# Altium schematic sheet driver.SchDoc
size A4; SheetNumber: 2; SheetTotal: 4
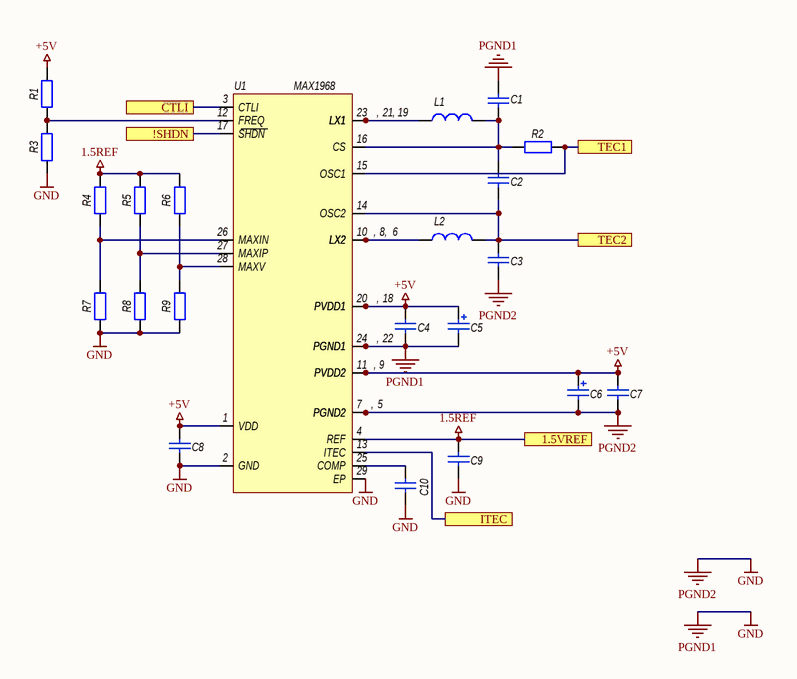
[diagram p0: driver.SchDoc]

## Parts
C1  0603 1u 6.3V  [CAP_0805]  (value not drawn)
C2  0805 10u 6.3V  [CAP_0805]  (value not drawn)
C3  0603 1u 6.3V  [CAP_0805]  (value not drawn)
C4  0603 1u 6.3V  [CAP_0805]  (value not drawn)
C5  47u 63V  [CAP 6.3x11]  (value not drawn)
C6  47u 63V  [CAP 6.3x11]  (value not drawn)
C7  0603 1u 6.3V  [CAP_0805]  (value not drawn)
C8  0603 1u 6.3V  [CAP_0805]  (value not drawn)
C9  0603 0.1u 6.3V  [CAP_0805]  (value not drawn)
C10  0603 1u 6.3V  [CAP_0805]  (value not drawn)
L1  LQH5BPN3R3NT0L  [IND_5050]  (value not drawn)
L2  LQH5BPN3R3NT0L  [IND_5050]  (value not drawn)
R1  0805 ?  [RES_0805]  (value not drawn)
R2  0805 50m  [RES_0805]  (value not drawn)
R3  0805 ?  [RES_0805]  (value not drawn)
R4  0805 ?  [RES_0805]  (value not drawn)
R5  0805 ?  [RES_0805]  (value not drawn)
R6  0805 ?  [RES_0805]  (value not drawn)
R7  0805 ?  [RES_0805]  (value not drawn)
R8  0805 ?  [RES_0805]  (value not drawn)
R9  0805 ?  [RES_0805]  (value not drawn)
U1  MAX1968  [TSSOP28+EP]

## Ports
1.5VREF, !SHDN, CTLI, ITEC, TEC1, TEC2

## Nets
1.5REF: C9.1 R4.2 R5.2 R6.2 U1.4(REF) ; port 1.5VREF
+5V: C4.1 C5.1 C6.1 C7.1 C8.1 R1.2 U1.1(VDD) U1.9(PVDD2) U1.11(PVDD2) U1.18(PVDD1) U1.20(PVDD1)
GND: C1.2 C3.2 C4.2 C5.2 C6.2 C7.2 C8.2 C9.2 C10.2 R3.1 R7.1 R8.1 R9.1 U1.2(GND) U1.5(PGND2) U1.7(PGND2) U1.22(PGND1) U1.24(PGND1) U1.29(EP)  [also labelled PGND1, PGND2]
!SHDN: U1.17(SHDN) ; port !SHDN
CTLI: U1.3(CTLI) ; port CTLI
ITEC: U1.13(ITEC) ; port ITEC
TEC1: R2.2 U1.15(OSC1) ; port TEC1
TEC2: C2.2 C3.1 L2.1 U1.14(OSC2) ; port TEC2
NetC1_1: C1.1 C2.1 L1.1 R2.1 U1.16(CS)
NetC10_1: C10.1 U1.25(COMP)
NetL1_2: L1.2 U1.19(LX1) U1.21(LX1) U1.23(LX1)
NetL2_2: L2.2 U1.6(LX2) U1.8(LX2) U1.10(LX2)
NetR1_1: R1.1 R3.2 U1.12(FREQ)
NetR4_1: R4.1 R7.2 U1.26(MAXIN)
NetR5_1: R5.1 R8.2 U1.27(MAXIP)
NetR6_1: R6.1 R9.2 U1.28(MAXV)

## Notes on the sheet
- (in symbol MAX1968) ,

## Library data of the parts
C1-C4 C7-C10 = Capacitor: Конденсатор
C5 C6 = CapacitorEl: Конденсатор электролитический; ValueBOM: 47u; ValueSCH: 47u 63V
L1 L2 = IND: Индуктивность
R1-R9 = Resisitor: Резистор
U1 = MAX1968: Драйвер пельтье